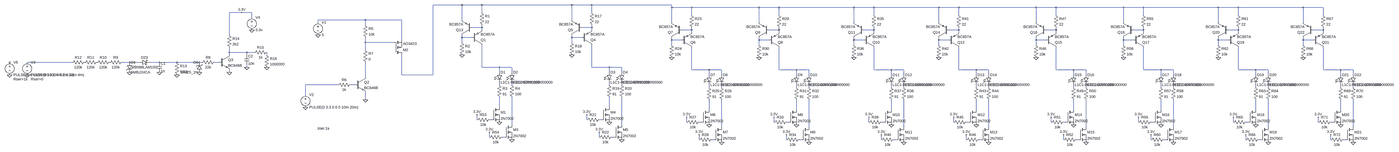
[diagram p0: schematic Draft2.asc, whole sheet]
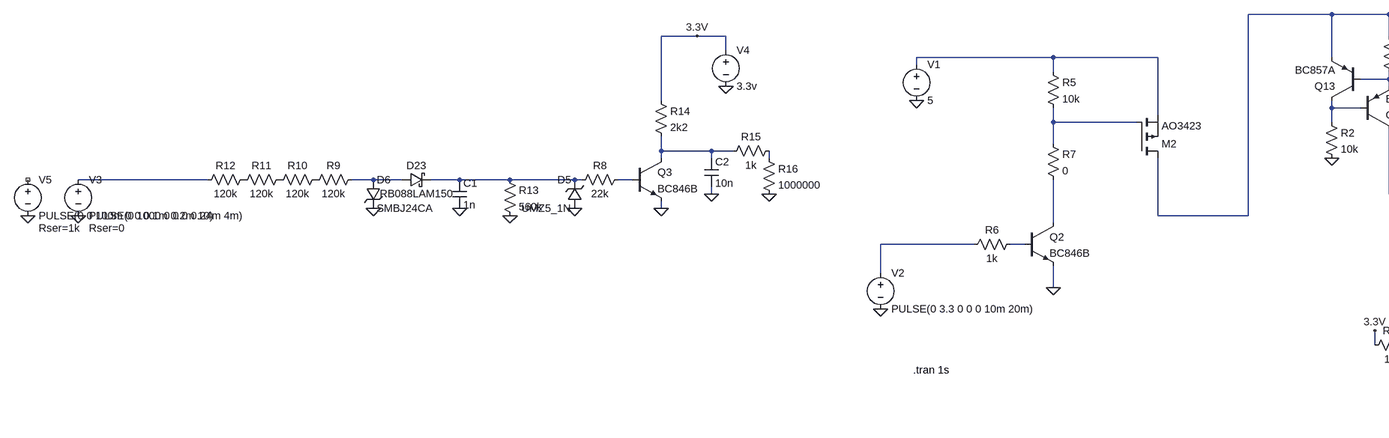
[diagram p1: schematic Draft2.asc, part, row 1 of 1, column 1 of 3]
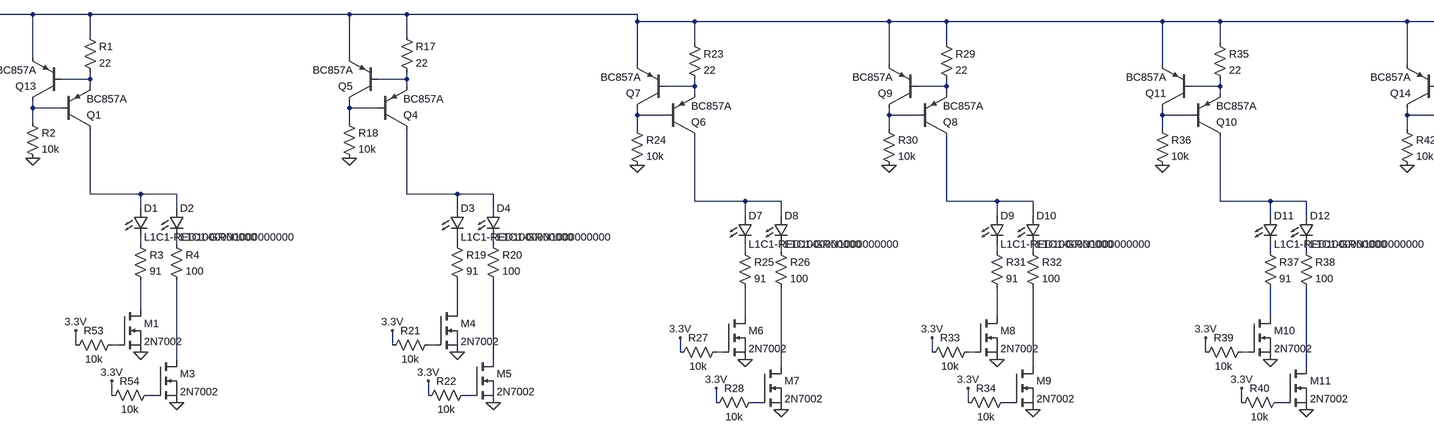
[diagram p2: schematic Draft2.asc, part, row 1 of 1, column 2 of 3]
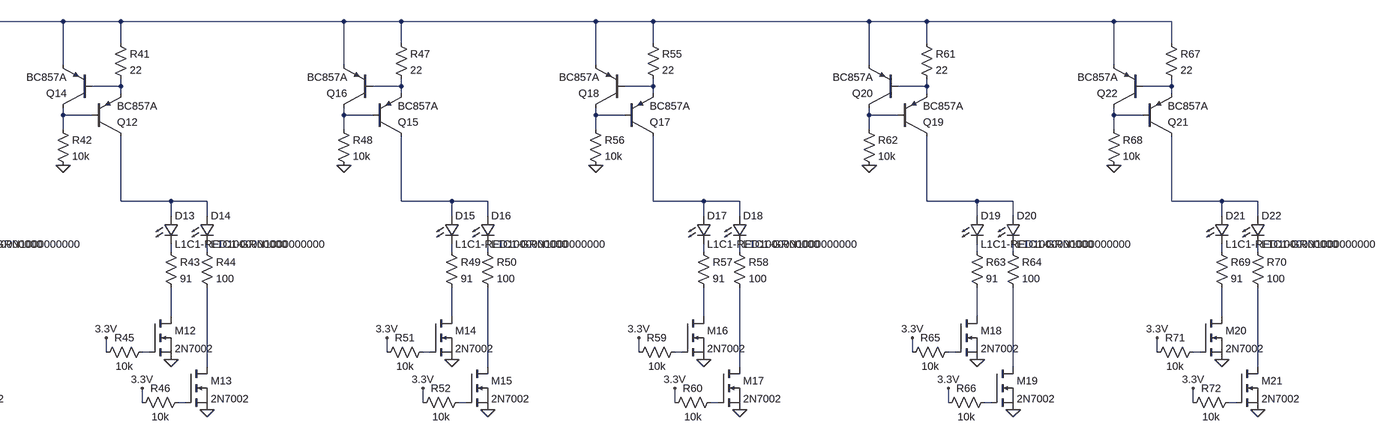
[diagram p3: schematic Draft2.asc, part, row 1 of 1, column 3 of 3]
Draft2.asc, the LTspice schematic file:
Version 4
SHEET 1 5988 872
WIRE 0 -288 -272 -288
WIRE 128 -288 0 -288
WIRE 704 -288 128 -288
WIRE 832 -288 704 -288
WIRE 1344 -288 832 -288
WIRE 1344 -272 1344 -288
WIRE 1472 -272 1344 -272
WIRE 1904 -272 1472 -272
WIRE 2032 -272 1904 -272
WIRE 2512 -272 2032 -272
WIRE 2640 -272 2512 -272
WIRE 3056 -272 2640 -272
WIRE 3184 -272 3056 -272
WIRE 3680 -272 3184 -272
WIRE 3808 -272 3680 -272
WIRE 4240 -272 3808 -272
WIRE 4368 -272 4240 -272
WIRE 4848 -272 4368 -272
WIRE 4976 -272 4848 -272
WIRE 5392 -272 4976 -272
WIRE 5520 -272 5392 -272
WIRE -1776 -240 -1856 -240
WIRE -1712 -240 -1776 -240
WIRE 128 -240 128 -288
WIRE 832 -240 832 -288
WIRE 1472 -224 1472 -272
WIRE 2032 -224 2032 -272
WIRE 2640 -224 2640 -272
WIRE 3184 -224 3184 -272
WIRE 3808 -224 3808 -272
WIRE 4368 -224 4368 -272
WIRE 4976 -224 4976 -272
WIRE 5520 -224 5520 -272
WIRE -1712 -208 -1712 -240
WIRE -864 -192 -1168 -192
WIRE -528 -192 -864 -192
WIRE 0 -192 0 -288
WIRE 704 -192 704 -288
WIRE -1168 -176 -1168 -192
WIRE 1344 -176 1344 -272
WIRE 1904 -176 1904 -272
WIRE 2512 -176 2512 -272
WIRE 3056 -176 3056 -272
WIRE 3680 -176 3680 -272
WIRE 4240 -176 4240 -272
WIRE 4848 -176 4848 -272
WIRE 5392 -176 5392 -272
WIRE -864 -160 -864 -192
WIRE 128 -144 128 -160
WIRE 128 -144 64 -144
WIRE 832 -144 832 -160
WIRE 832 -144 768 -144
WIRE 128 -128 128 -144
WIRE 832 -128 832 -144
WIRE 1472 -128 1472 -144
WIRE 1472 -128 1408 -128
WIRE 2032 -128 2032 -144
WIRE 2032 -128 1968 -128
WIRE 2640 -128 2640 -144
WIRE 2640 -128 2576 -128
WIRE 3184 -128 3184 -144
WIRE 3184 -128 3120 -128
WIRE 3808 -128 3808 -144
WIRE 3808 -128 3744 -128
WIRE 4368 -128 4368 -144
WIRE 4368 -128 4304 -128
WIRE 4976 -128 4976 -144
WIRE 4976 -128 4912 -128
WIRE 5520 -128 5520 -144
WIRE 5520 -128 5456 -128
WIRE 1472 -112 1472 -128
WIRE 2032 -112 2032 -128
WIRE 2640 -112 2640 -128
WIRE 3184 -112 3184 -128
WIRE 3808 -112 3808 -128
WIRE 4368 -112 4368 -128
WIRE 4976 -112 4976 -128
WIRE 5520 -112 5520 -128
WIRE -1856 -96 -1856 -240
WIRE 0 -80 0 -96
WIRE 64 -80 0 -80
WIRE 704 -80 704 -96
WIRE 768 -80 704 -80
WIRE -528 -64 -528 -192
WIRE 1344 -64 1344 -80
WIRE 1408 -64 1344 -64
WIRE 1904 -64 1904 -80
WIRE 1968 -64 1904 -64
WIRE 2512 -64 2512 -80
WIRE 2576 -64 2512 -64
WIRE 3056 -64 3056 -80
WIRE 3120 -64 3056 -64
WIRE 3680 -64 3680 -80
WIRE 3744 -64 3680 -64
WIRE 4240 -64 4240 -80
WIRE 4304 -64 4240 -64
WIRE 4848 -64 4848 -80
WIRE 4912 -64 4848 -64
WIRE 5392 -64 5392 -80
WIRE 5456 -64 5392 -64
WIRE -864 -48 -864 -80
WIRE -576 -48 -864 -48
WIRE 0 -48 0 -80
WIRE 704 -48 704 -80
WIRE 1344 -32 1344 -64
WIRE 1904 -32 1904 -64
WIRE 2512 -32 2512 -64
WIRE 3056 -32 3056 -64
WIRE 3680 -32 3680 -64
WIRE 4240 -32 4240 -64
WIRE 4848 -32 4848 -64
WIRE 5392 -32 5392 -64
WIRE -864 0 -864 -48
WIRE -1856 16 -1856 -16
WIRE -1744 16 -1856 16
WIRE -1696 16 -1744 16
WIRE -1856 32 -1856 16
WIRE -1744 32 -1744 16
WIRE -1616 32 -1616 16
WIRE -2864 80 -3152 80
WIRE -2496 80 -2544 80
WIRE -2432 80 -2496 80
WIRE -2304 80 -2368 80
WIRE -2192 80 -2304 80
WIRE -2048 80 -2192 80
WIRE -2032 80 -2048 80
WIRE -1920 80 -1952 80
WIRE -1744 112 -1744 96
WIRE 128 112 128 -32
WIRE 240 112 128 112
WIRE 320 112 240 112
WIRE 832 112 832 -32
WIRE 944 112 832 112
WIRE 1024 112 944 112
WIRE 1472 128 1472 -16
WIRE 1584 128 1472 128
WIRE 1664 128 1584 128
WIRE 2032 128 2032 -16
WIRE 2144 128 2032 128
WIRE 2224 128 2144 128
WIRE 2640 128 2640 -16
WIRE 2752 128 2640 128
WIRE 2832 128 2752 128
WIRE 3184 128 3184 -16
WIRE 3296 128 3184 128
WIRE 3376 128 3296 128
WIRE 3808 128 3808 -16
WIRE 3920 128 3808 128
WIRE 4000 128 3920 128
WIRE 4368 128 4368 -16
WIRE 4480 128 4368 128
WIRE 4560 128 4480 128
WIRE 4976 128 4976 -16
WIRE 5088 128 4976 128
WIRE 5168 128 5088 128
WIRE 5520 128 5520 -16
WIRE 5632 128 5520 128
WIRE 5712 128 5632 128
WIRE -1856 144 -1856 128
WIRE 240 144 240 112
WIRE 320 144 320 112
WIRE 944 144 944 112
WIRE 1024 144 1024 112
WIRE -528 160 -528 32
WIRE -272 160 -272 -288
WIRE -272 160 -528 160
WIRE 1584 160 1584 128
WIRE 1664 160 1664 128
WIRE 2144 160 2144 128
WIRE 2224 160 2224 128
WIRE 2752 160 2752 128
WIRE 2832 160 2832 128
WIRE 3296 160 3296 128
WIRE 3376 160 3376 128
WIRE 3920 160 3920 128
WIRE 4000 160 4000 128
WIRE 4480 160 4480 128
WIRE 4560 160 4560 128
WIRE 5088 160 5088 128
WIRE 5168 160 5168 128
WIRE 5632 160 5632 128
WIRE 5712 160 5712 128
WIRE -864 176 -864 80
WIRE -1040 224 -1248 224
WIRE -928 224 -960 224
WIRE 240 224 240 208
WIRE 320 224 320 208
WIRE 944 224 944 208
WIRE 1024 224 1024 208
WIRE 1584 240 1584 224
WIRE 1664 240 1664 224
WIRE 2144 240 2144 224
WIRE 2224 240 2224 224
WIRE 2752 240 2752 224
WIRE 2832 240 2832 224
WIRE 3296 240 3296 224
WIRE 3376 240 3376 224
WIRE 3920 240 3920 224
WIRE 4000 240 4000 224
WIRE 4480 240 4480 224
WIRE 4560 240 4560 224
WIRE 5088 240 5088 224
WIRE 5168 240 5168 224
WIRE 5632 240 5632 224
WIRE 5712 240 5712 224
WIRE -1248 288 -1248 224
WIRE -864 320 -864 272
WIRE 240 368 240 304
WIRE 944 368 944 304
WIRE 1584 384 1584 320
WIRE 2144 384 2144 320
WIRE 2752 384 2752 320
WIRE 3296 384 3296 320
WIRE 3920 384 3920 320
WIRE 4480 384 4480 320
WIRE 5088 384 5088 320
WIRE 5632 384 5632 320
WIRE 96 448 96 416
WIRE 192 448 176 448
WIRE 800 448 800 416
WIRE 896 448 880 448
WIRE 1440 464 1440 432
WIRE 1536 464 1520 464
WIRE 2000 464 2000 432
WIRE 2096 464 2080 464
WIRE 2608 464 2608 432
WIRE 2704 464 2688 464
WIRE 3152 464 3152 432
WIRE 3248 464 3232 464
WIRE 3776 464 3776 432
WIRE 3872 464 3856 464
WIRE 4336 464 4336 432
WIRE 4432 464 4416 464
WIRE 4944 464 4944 432
WIRE 5040 464 5024 464
WIRE 5488 464 5488 432
WIRE 5584 464 5568 464
WIRE 320 480 320 304
WIRE 1024 480 1024 304
WIRE 1664 496 1664 320
WIRE 2224 496 2224 320
WIRE 2832 496 2832 320
WIRE 3376 496 3376 320
WIRE 4000 496 4000 320
WIRE 4560 496 4560 320
WIRE 5168 496 5168 320
WIRE 5712 496 5712 320
WIRE 176 560 176 528
WIRE 272 560 256 560
WIRE 880 560 880 528
WIRE 976 560 960 560
WIRE 1520 576 1520 544
WIRE 1616 576 1600 576
WIRE 2080 576 2080 544
WIRE 2176 576 2160 576
WIRE 2688 576 2688 544
WIRE 2784 576 2768 576
WIRE 3232 576 3232 544
WIRE 3328 576 3312 576
WIRE 3856 576 3856 544
WIRE 3952 576 3936 576
WIRE 4416 576 4416 544
WIRE 4512 576 4496 576
WIRE 5024 576 5024 544
WIRE 5120 576 5104 576
WIRE 5568 576 5568 544
WIRE 5664 576 5648 576
FLAG 0 32 0
FLAG -1168 -96 0
FLAG -1248 368 0
FLAG -864 320 0
FLAG -3152 160 0
FLAG -1856 144 0
FLAG -1616 112 0
FLAG -2192 160 0
FLAG -1712 -128 0
FLAG -3264 160 0
FLAG -1744 112 0
FLAG 320 576 0
FLAG 240 464 0
FLAG -1776 -240 3.3V
FLAG 96 416 3.3V
FLAG 176 528 3.3V
FLAG 704 32 0
FLAG 1024 576 0
FLAG 944 464 0
FLAG 800 416 3.3V
FLAG 880 528 3.3V
FLAG 1344 48 0
FLAG 1664 592 0
FLAG 1584 480 0
FLAG 1440 432 3.3V
FLAG 1520 544 3.3V
FLAG 1904 48 0
FLAG 2224 592 0
FLAG 2144 480 0
FLAG 2000 432 3.3V
FLAG 2080 544 3.3V
FLAG 2512 48 0
FLAG 2832 592 0
FLAG 2752 480 0
FLAG 2608 432 3.3V
FLAG 2688 544 3.3V
FLAG 3056 48 0
FLAG 3376 592 0
FLAG 3296 480 0
FLAG 3152 432 3.3V
FLAG 3232 544 3.3V
FLAG 3680 48 0
FLAG 4000 592 0
FLAG 3920 480 0
FLAG 3776 432 3.3V
FLAG 3856 544 3.3V
FLAG 4240 48 0
FLAG 4560 592 0
FLAG 4480 480 0
FLAG 4336 432 3.3V
FLAG 4416 544 3.3V
FLAG 4848 48 0
FLAG 5168 592 0
FLAG 5088 480 0
FLAG 4944 432 3.3V
FLAG 5024 544 3.3V
FLAG 5392 48 0
FLAG 5712 592 0
FLAG 5632 480 0
FLAG 5488 432 3.3V
FLAG 5568 544 3.3V
FLAG -2304 144 0
FLAG -2496 144 0
FLAG -2048 144 0
SYMBOL LED 224 144 R0
SYMATTR InstName D1
SYMATTR Value L1C1-RED1000000000
SYMBOL LED 304 144 R0
SYMATTR InstName D2
SYMATTR Value L1C1-GRN1000000000
SYMBOL pnp 64 -32 M180
SYMATTR InstName Q1
SYMATTR Value BC857A
SYMBOL res 112 -256 R0
SYMATTR InstName R1
SYMATTR Value 22
SYMBOL res -16 -64 R0
SYMATTR InstName R2
SYMATTR Value 10k
SYMBOL voltage -1168 -192 R0
WINDOW 123 0 0 Left 0
WINDOW 39 0 0 Left 0
SYMATTR InstName V1
SYMATTR Value 5
SYMBOL res 224 208 R0
SYMATTR InstName R3
SYMATTR Value 91
SYMBOL res 304 208 R0
SYMATTR InstName R4
SYMATTR Value 100
SYMBOL pmos -576 32 M180
SYMATTR InstName M2
SYMATTR Value AO3423
SYMBOL res -880 -176 R0
SYMATTR InstName R5
SYMATTR Value 10k
SYMBOL voltage -1248 272 R0
WINDOW 123 0 0 Left 0
WINDOW 39 0 0 Left 0
SYMATTR InstName V2
SYMATTR Value PULSE(0 3.3 0 0 0 10m 20m)
SYMBOL npn -928 176 R0
SYMATTR InstName Q2
SYMATTR Value BC846B
SYMBOL res -944 208 R90
WINDOW 0 0 56 VBottom 2
WINDOW 3 32 56 VTop 2
SYMATTR InstName R6
SYMATTR Value 1k
SYMBOL res -880 -16 R0
SYMATTR InstName R7
SYMATTR Value 0
SYMBOL npn -1920 32 R0
SYMATTR InstName Q3
SYMATTR Value BC846B
SYMBOL res -1936 64 R90
WINDOW 0 0 56 VBottom 2
WINDOW 3 32 56 VTop 2
SYMATTR InstName R8
SYMATTR Value 22k
SYMBOL cap -2320 80 R0
SYMATTR InstName C1
SYMATTR Value 1n
SYMBOL zener -2032 144 R180
WINDOW 0 24 64 Left 2
WINDOW 3 24 0 Left 2
SYMATTR InstName D5
SYMATTR Value UMZ5_1N
SYMBOL voltage -3152 64 R0
WINDOW 123 0 0 Left 0
WINDOW 39 24 124 Left 2
SYMATTR SpiceLine Rser=0
SYMATTR InstName V3
SYMATTR Value PULSE(0 1000 0 0 0 0.24m 4m)
SYMBOL res -2528 64 R90
WINDOW 0 0 56 VBottom 2
WINDOW 3 32 56 VTop 2
SYMATTR InstName R9
SYMATTR Value 120k
SYMBOL res -2608 64 R90
WINDOW 0 0 56 VBottom 2
WINDOW 3 32 56 VTop 2
SYMATTR InstName R10
SYMATTR Value 120k
SYMBOL res -2688 64 R90
WINDOW 0 0 56 VBottom 2
WINDOW 3 32 56 VTop 2
SYMATTR InstName R11
SYMATTR Value 120k
SYMBOL res -2768 64 R90
WINDOW 0 0 56 VBottom 2
WINDOW 3 32 56 VTop 2
SYMATTR InstName R12
SYMATTR Value 120k
SYMBOL res -2208 64 R0
SYMATTR InstName R13
SYMATTR Value 560k
SYMBOL res -1872 -112 R0
SYMATTR InstName R14
SYMATTR Value 2k2
SYMBOL res -1600 0 R90
WINDOW 0 0 56 VBottom 2
WINDOW 3 32 56 VTop 2
SYMATTR InstName R15
SYMATTR Value 1k
SYMBOL res -1632 16 R0
SYMATTR InstName R16
SYMATTR Value 1000000
SYMBOL voltage -1712 -224 R0
WINDOW 123 0 0 Left 0
WINDOW 39 0 0 Left 0
SYMATTR InstName V4
SYMATTR Value 3.3v
SYMBOL voltage -3264 64 R0
WINDOW 123 0 0 Left 0
WINDOW 39 24 124 Left 2
SYMATTR SpiceLine Rser=1k
SYMATTR InstName V5
SYMATTR Value PULSE(0 0 100m 0 0 0.1m 0.2m 10)
SYMBOL cap -1760 32 R0
SYMATTR InstName C2
SYMATTR Value 10n
SYMBOL nmos 192 368 R0
SYMATTR InstName M1
SYMATTR Value 2N7002
SYMBOL nmos 272 480 R0
SYMATTR InstName M3
SYMATTR Value 2N7002
SYMBOL res 192 432 R90
WINDOW 0 0 56 VBottom 2
WINDOW 3 32 56 VTop 2
SYMATTR InstName R53
SYMATTR Value 10k
SYMBOL res 272 544 R90
WINDOW 0 0 56 VBottom 2
WINDOW 3 32 56 VTop 2
SYMATTR InstName R54
SYMATTR Value 10k
SYMBOL pnp 64 -96 R180
SYMATTR InstName Q13
SYMATTR Value BC857A
SYMBOL LED 928 144 R0
SYMATTR InstName D3
SYMATTR Value L1C1-RED1000000000
SYMBOL LED 1008 144 R0
SYMATTR InstName D4
SYMATTR Value L1C1-GRN1000000000
SYMBOL pnp 768 -32 M180
SYMATTR InstName Q4
SYMATTR Value BC857A
SYMBOL res 816 -256 R0
SYMATTR InstName R17
SYMATTR Value 22
SYMBOL res 688 -64 R0
SYMATTR InstName R18
SYMATTR Value 10k
SYMBOL res 928 208 R0
SYMATTR InstName R19
SYMATTR Value 91
SYMBOL res 1008 208 R0
SYMATTR InstName R20
SYMATTR Value 100
SYMBOL nmos 896 368 R0
SYMATTR InstName M4
SYMATTR Value 2N7002
SYMBOL nmos 976 480 R0
SYMATTR InstName M5
SYMATTR Value 2N7002
SYMBOL res 896 432 R90
WINDOW 0 0 56 VBottom 2
WINDOW 3 32 56 VTop 2
SYMATTR InstName R21
SYMATTR Value 10k
SYMBOL res 976 544 R90
WINDOW 0 0 56 VBottom 2
WINDOW 3 32 56 VTop 2
SYMATTR InstName R22
SYMATTR Value 10k
SYMBOL pnp 768 -96 R180
SYMATTR InstName Q5
SYMATTR Value BC857A
SYMBOL LED 1568 160 R0
SYMATTR InstName D7
SYMATTR Value L1C1-RED1000000000
SYMBOL LED 1648 160 R0
SYMATTR InstName D8
SYMATTR Value L1C1-GRN1000000000
SYMBOL pnp 1408 -16 M180
SYMATTR InstName Q6
SYMATTR Value BC857A
SYMBOL res 1456 -240 R0
SYMATTR InstName R23
SYMATTR Value 22
SYMBOL res 1328 -48 R0
SYMATTR InstName R24
SYMATTR Value 10k
SYMBOL res 1568 224 R0
SYMATTR InstName R25
SYMATTR Value 91
SYMBOL res 1648 224 R0
SYMATTR InstName R26
SYMATTR Value 100
SYMBOL nmos 1536 384 R0
SYMATTR InstName M6
SYMATTR Value 2N7002
SYMBOL nmos 1616 496 R0
SYMATTR InstName M7
SYMATTR Value 2N7002
SYMBOL res 1536 448 R90
WINDOW 0 0 56 VBottom 2
WINDOW 3 32 56 VTop 2
SYMATTR InstName R27
SYMATTR Value 10k
SYMBOL res 1616 560 R90
WINDOW 0 0 56 VBottom 2
WINDOW 3 32 56 VTop 2
SYMATTR InstName R28
SYMATTR Value 10k
SYMBOL pnp 1408 -80 R180
SYMATTR InstName Q7
SYMATTR Value BC857A
SYMBOL LED 2128 160 R0
SYMATTR InstName D9
SYMATTR Value L1C1-RED1000000000
SYMBOL LED 2208 160 R0
SYMATTR InstName D10
SYMATTR Value L1C1-GRN1000000000
SYMBOL pnp 1968 -16 M180
SYMATTR InstName Q8
SYMATTR Value BC857A
SYMBOL res 2016 -240 R0
SYMATTR InstName R29
SYMATTR Value 22
SYMBOL res 1888 -48 R0
SYMATTR InstName R30
SYMATTR Value 10k
SYMBOL res 2128 224 R0
SYMATTR InstName R31
SYMATTR Value 91
SYMBOL res 2208 224 R0
SYMATTR InstName R32
SYMATTR Value 100
SYMBOL nmos 2096 384 R0
SYMATTR InstName M8
SYMATTR Value 2N7002
SYMBOL nmos 2176 496 R0
SYMATTR InstName M9
SYMATTR Value 2N7002
SYMBOL res 2096 448 R90
WINDOW 0 0 56 VBottom 2
WINDOW 3 32 56 VTop 2
SYMATTR InstName R33
SYMATTR Value 10k
SYMBOL res 2176 560 R90
WINDOW 0 0 56 VBottom 2
WINDOW 3 32 56 VTop 2
SYMATTR InstName R34
SYMATTR Value 10k
SYMBOL pnp 1968 -80 R180
SYMATTR InstName Q9
SYMATTR Value BC857A
SYMBOL LED 2736 160 R0
SYMATTR InstName D11
SYMATTR Value L1C1-RED1000000000
SYMBOL LED 2816 160 R0
SYMATTR InstName D12
SYMATTR Value L1C1-GRN1000000000
SYMBOL pnp 2576 -16 M180
SYMATTR InstName Q10
SYMATTR Value BC857A
SYMBOL res 2624 -240 R0
SYMATTR InstName R35
SYMATTR Value 22
SYMBOL res 2496 -48 R0
SYMATTR InstName R36
SYMATTR Value 10k
SYMBOL res 2736 224 R0
SYMATTR InstName R37
SYMATTR Value 91
SYMBOL res 2816 224 R0
SYMATTR InstName R38
SYMATTR Value 100
SYMBOL nmos 2704 384 R0
SYMATTR InstName M10
SYMATTR Value 2N7002
SYMBOL nmos 2784 496 R0
SYMATTR InstName M11
SYMATTR Value 2N7002
SYMBOL res 2704 448 R90
WINDOW 0 0 56 VBottom 2
WINDOW 3 32 56 VTop 2
SYMATTR InstName R39
SYMATTR Value 10k
SYMBOL res 2784 560 R90
WINDOW 0 0 56 VBottom 2
WINDOW 3 32 56 VTop 2
SYMATTR InstName R40
SYMATTR Value 10k
SYMBOL pnp 2576 -80 R180
SYMATTR InstName Q11
SYMATTR Value BC857A
SYMBOL LED 3280 160 R0
SYMATTR InstName D13
SYMATTR Value L1C1-RED1000000000
SYMBOL LED 3360 160 R0
SYMATTR InstName D14
SYMATTR Value L1C1-GRN1000000000
SYMBOL pnp 3120 -16 M180
SYMATTR InstName Q12
SYMATTR Value BC857A
SYMBOL res 3168 -240 R0
SYMATTR InstName R41
SYMATTR Value 22
SYMBOL res 3040 -48 R0
SYMATTR InstName R42
SYMATTR Value 10k
SYMBOL res 3280 224 R0
SYMATTR InstName R43
SYMATTR Value 91
SYMBOL res 3360 224 R0
SYMATTR InstName R44
SYMATTR Value 100
SYMBOL nmos 3248 384 R0
SYMATTR InstName M12
SYMATTR Value 2N7002
SYMBOL nmos 3328 496 R0
SYMATTR InstName M13
SYMATTR Value 2N7002
SYMBOL res 3248 448 R90
WINDOW 0 0 56 VBottom 2
WINDOW 3 32 56 VTop 2
SYMATTR InstName R45
SYMATTR Value 10k
SYMBOL res 3328 560 R90
WINDOW 0 0 56 VBottom 2
WINDOW 3 32 56 VTop 2
SYMATTR InstName R46
SYMATTR Value 10k
SYMBOL pnp 3120 -80 R180
SYMATTR InstName Q14
SYMATTR Value BC857A
SYMBOL LED 3904 160 R0
SYMATTR InstName D15
SYMATTR Value L1C1-RED1000000000
SYMBOL LED 3984 160 R0
SYMATTR InstName D16
SYMATTR Value L1C1-GRN1000000000
SYMBOL pnp 3744 -16 M180
SYMATTR InstName Q15
SYMATTR Value BC857A
SYMBOL res 3792 -240 R0
SYMATTR InstName R47
SYMATTR Value 22
SYMBOL res 3664 -48 R0
SYMATTR InstName R48
SYMATTR Value 10k
SYMBOL res 3904 224 R0
SYMATTR InstName R49
SYMATTR Value 91
SYMBOL res 3984 224 R0
SYMATTR InstName R50
SYMATTR Value 100
SYMBOL nmos 3872 384 R0
SYMATTR InstName M14
SYMATTR Value 2N7002
SYMBOL nmos 3952 496 R0
SYMATTR InstName M15
SYMATTR Value 2N7002
SYMBOL res 3872 448 R90
WINDOW 0 0 56 VBottom 2
WINDOW 3 32 56 VTop 2
SYMATTR InstName R51
SYMATTR Value 10k
SYMBOL res 3952 560 R90
WINDOW 0 0 56 VBottom 2
WINDOW 3 32 56 VTop 2
SYMATTR InstName R52
SYMATTR Value 10k
SYMBOL pnp 3744 -80 R180
SYMATTR InstName Q16
SYMATTR Value BC857A
SYMBOL LED 4464 160 R0
SYMATTR InstName D17
SYMATTR Value L1C1-RED1000000000
SYMBOL LED 4544 160 R0
SYMATTR InstName D18
SYMATTR Value L1C1-GRN1000000000
SYMBOL pnp 4304 -16 M180
SYMATTR InstName Q17
SYMATTR Value BC857A
SYMBOL res 4352 -240 R0
SYMATTR InstName R55
SYMATTR Value 22
SYMBOL res 4224 -48 R0
SYMATTR InstName R56
SYMATTR Value 10k
SYMBOL res 4464 224 R0
SYMATTR InstName R57
SYMATTR Value 91
SYMBOL res 4544 224 R0
SYMATTR InstName R58
SYMATTR Value 100
SYMBOL nmos 4432 384 R0
SYMATTR InstName M16
SYMATTR Value 2N7002
SYMBOL nmos 4512 496 R0
SYMATTR InstName M17
SYMATTR Value 2N7002
SYMBOL res 4432 448 R90
WINDOW 0 0 56 VBottom 2
WINDOW 3 32 56 VTop 2
SYMATTR InstName R59
SYMATTR Value 10k
SYMBOL res 4512 560 R90
WINDOW 0 0 56 VBottom 2
WINDOW 3 32 56 VTop 2
SYMATTR InstName R60
SYMATTR Value 10k
SYMBOL pnp 4304 -80 R180
SYMATTR InstName Q18
SYMATTR Value BC857A
SYMBOL LED 5072 160 R0
SYMATTR InstName D19
SYMATTR Value L1C1-RED1000000000
SYMBOL LED 5152 160 R0
SYMATTR InstName D20
SYMATTR Value L1C1-GRN1000000000
SYMBOL pnp 4912 -16 M180
SYMATTR InstName Q19
SYMATTR Value BC857A
SYMBOL res 4960 -240 R0
SYMATTR InstName R61
SYMATTR Value 22
SYMBOL res 4832 -48 R0
SYMATTR InstName R62
SYMATTR Value 10k
SYMBOL res 5072 224 R0
SYMATTR InstName R63
SYMATTR Value 91
SYMBOL res 5152 224 R0
SYMATTR InstName R64
SYMATTR Value 100
SYMBOL nmos 5040 384 R0
SYMATTR InstName M18
SYMATTR Value 2N7002
SYMBOL nmos 5120 496 R0
SYMATTR InstName M19
SYMATTR Value 2N7002
SYMBOL res 5040 448 R90
WINDOW 0 0 56 VBottom 2
WINDOW 3 32 56 VTop 2
SYMATTR InstName R65
SYMATTR Value 10k
SYMBOL res 5120 560 R90
WINDOW 0 0 56 VBottom 2
WINDOW 3 32 56 VTop 2
SYMATTR InstName R66
SYMATTR Value 10k
SYMBOL pnp 4912 -80 R180
SYMATTR InstName Q20
SYMATTR Value BC857A
SYMBOL LED 5616 160 R0
SYMATTR InstName D21
SYMATTR Value L1C1-RED1000000000
SYMBOL LED 5696 160 R0
SYMATTR InstName D22
SYMATTR Value L1C1-GRN1000000000
SYMBOL pnp 5456 -16 M180
SYMATTR InstName Q21
SYMATTR Value BC857A
SYMBOL res 5504 -240 R0
SYMATTR InstName R67
SYMATTR Value 22
SYMBOL res 5376 -48 R0
SYMATTR InstName R68
SYMATTR Value 10k
SYMBOL res 5616 224 R0
SYMATTR InstName R69
SYMATTR Value 91
SYMBOL res 5696 224 R0
SYMATTR InstName R70
SYMATTR Value 100
SYMBOL nmos 5584 384 R0
SYMATTR InstName M20
SYMATTR Value 2N7002
SYMBOL nmos 5664 496 R0
SYMATTR InstName M21
SYMATTR Value 2N7002
SYMBOL res 5584 448 R90
WINDOW 0 0 56 VBottom 2
WINDOW 3 32 56 VTop 2
SYMATTR InstName R71
SYMATTR Value 10k
SYMBOL res 5664 560 R90
WINDOW 0 0 56 VBottom 2
WINDOW 3 32 56 VTop 2
SYMATTR InstName R72
SYMATTR Value 10k
SYMBOL pnp 5456 -80 R180
SYMATTR InstName Q22
SYMATTR Value BC857A
SYMBOL TVSdiode -2512 80 R0
SYMATTR InstName D6
SYMATTR Value SMBJ24CA
SYMBOL schottky -2432 96 R270
WINDOW 0 32 32 VTop 2
WINDOW 3 0 32 VBottom 2
SYMATTR InstName D23
SYMATTR Value RB088LAM150
TEXT -1176 504 Left 2 !.tran 1s

The netlist it stands for:
* Draft2.asc
D1 N030 N043 L1C1-RED1000000000
D2 N030 N044 L1C1-GRN1000000000
Q1 N030 N013 N003 0 BC857A
R1 N001 N003 22
R2 N013 0 10k
V1 N002 0 5
R3 N043 N063 91
R4 N044 N083 100
M2 N001 N023 N002 N002 AO3423
R5 N002 N023 10k
V2 N041 0 PULSE(0 3.3 0 0 0 10m 20m)
Q2 N040 N042 0 0 BC846B
R6 N042 N041 1k
R7 N023 N040 0
Q3 N024 N029 0 0 BC846B
R8 N029 N028 22k
C1 N028 0 1n
D5 0 N028 UMZ5_1N
V3 N026 0 PULSE(0 1000 0 0 0 0.24m 4m) Rser=0
R9 N027 P001 120k
R10 P001 P002 120k
R11 P002 P003 120k
R12 P003 N026 120k
R13 N028 0 560k
R14 3.3V N024 2k2
R15 N025 N024 1k
R16 N025 0 1000000
V4 3.3V 0 3.3v
V5 NC_01 0 PULSE(0 0 100m 0 0 0.1m 0.2m 10) Rser=1k
C2 N024 0 10n
M1 N063 N073 0 0 2N7002
M3 N083 N093 0 0 2N7002
R53 N073 3.3V 10k
R54 N093 3.3V 10k
Q13 N013 N003 N001 0 BC857A
D3 N031 N045 L1C1-RED1000000000
D4 N031 N046 L1C1-GRN1000000000
Q4 N031 N014 N004 0 BC857A
R17 N001 N004 22
R18 N014 0 10k
R19 N045 N064 91
R20 N046 N084 100
M4 N064 N074 0 0 2N7002
M5 N084 N094 0 0 2N7002
R21 N074 3.3V 10k
R22 N094 3.3V 10k
Q5 N014 N004 N001 0 BC857A
D7 N032 N047 L1C1-RED1000000000
D8 N032 N048 L1C1-GRN1000000000
Q6 N032 N015 N005 0 BC857A
R23 N001 N005 22
R24 N015 0 10k
R25 N047 N065 91
R26 N048 N085 100
M6 N065 N075 0 0 2N7002
M7 N085 N095 0 0 2N7002
R27 N075 3.3V 10k
R28 N095 3.3V 10k
Q7 N015 N005 N001 0 BC857A
D9 N033 N049 L1C1-RED1000000000
D10 N033 N050 L1C1-GRN1000000000
Q8 N033 N016 N006 0 BC857A
R29 N001 N006 22
R30 N016 0 10k
R31 N049 N066 91
R32 N050 N086 100
M8 N066 N076 0 0 2N7002
M9 N086 N096 0 0 2N7002
R33 N076 3.3V 10k
R34 N096 3.3V 10k
Q9 N016 N006 N001 0 BC857A
D11 N034 N051 L1C1-RED1000000000
D12 N034 N052 L1C1-GRN1000000000
Q10 N034 N017 N007 0 BC857A
R35 N001 N007 22
R36 N017 0 10k
R37 N051 N067 91
R38 N052 N087 100
M10 N067 N077 0 0 2N7002
M11 N087 N097 0 0 2N7002
R39 N077 3.3V 10k
R40 N097 3.3V 10k
Q11 N017 N007 N001 0 BC857A
D13 N035 N053 L1C1-RED1000000000
D14 N035 N054 L1C1-GRN1000000000
Q12 N035 N018 N008 0 BC857A
R41 N001 N008 22
R42 N018 0 10k
R43 N053 N068 91
R44 N054 N088 100
M12 N068 N078 0 0 2N7002
M13 N088 N098 0 0 2N7002
R45 N078 3.3V 10k
R46 N098 3.3V 10k
Q14 N018 N008 N001 0 BC857A
D15 N036 N055 L1C1-RED1000000000
D16 N036 N056 L1C1-GRN1000000000
Q15 N036 N019 N009 0 BC857A
R47 N001 N009 22
R48 N019 0 10k
R49 N055 N069 91
R50 N056 N089 100
M14 N069 N079 0 0 2N7002
M15 N089 N099 0 0 2N7002
R51 N079 3.3V 10k
R52 N099 3.3V 10k
Q16 N019 N009 N001 0 BC857A
D17 N037 N057 L1C1-RED1000000000
D18 N037 N058 L1C1-GRN1000000000
Q17 N037 N020 N010 0 BC857A
R55 N001 N010 22
R56 N020 0 10k
R57 N057 N070 91
R58 N058 N090 100
M16 N070 N080 0 0 2N7002
M17 N090 N100 0 0 2N7002
R59 N080 3.3V 10k
R60 N100 3.3V 10k
Q18 N020 N010 N001 0 BC857A
D19 N038 N059 L1C1-RED1000000000
D20 N038 N060 L1C1-GRN1000000000
Q19 N038 N021 N011 0 BC857A
R61 N001 N011 22
R62 N021 0 10k
R63 N059 N071 91
R64 N060 N091 100
M18 N071 N081 0 0 2N7002
M19 N091 N101 0 0 2N7002
R65 N081 3.3V 10k
R66 N101 3.3V 10k
Q20 N021 N011 N001 0 BC857A
D21 N039 N061 L1C1-RED1000000000
D22 N039 N062 L1C1-GRN1000000000
Q21 N039 N022 N012 0 BC857A
R67 N001 N012 22
R68 N022 0 10k
R69 N061 N072 91
R70 N062 N092 100
M20 N072 N082 0 0 2N7002
M21 N092 N102 0 0 2N7002
R71 N082 3.3V 10k
R72 N102 3.3V 10k
Q22 N022 N012 N001 0 BC857A
D6 N027 0 SMBJ24CA
D23 N027 N028 RB088LAM150
.model D D
.lib standard.dio
.model NPN NPN
.model PNP PNP
.lib standard.bjt
.model NMOS NMOS
.model PMOS PMOS
.lib standard.mos
.tran 1s
.backanno
.end